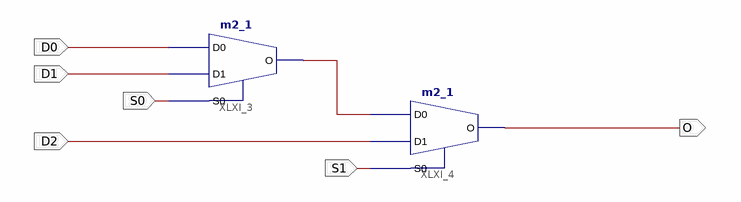
[diagram p0: schematic sheet 1]
// Xilinx ISE schematic mux3to1.sch (spartan3e) as structural Verilog: 2 symbols, 6 ports
module mux3to1 (
  input  D0,
  input  D1,
  input  D2,
  input  S0,
  input  S1,
  output O
);

  wire XLXN_8;

  m2_1 XLXI_3 (.D0(D0), .D1(D1), .S0(S0), .O(XLXN_8));
  m2_1 XLXI_4 (.D0(XLXN_8), .D1(D2), .S0(S1), .O(O));
endmodule
